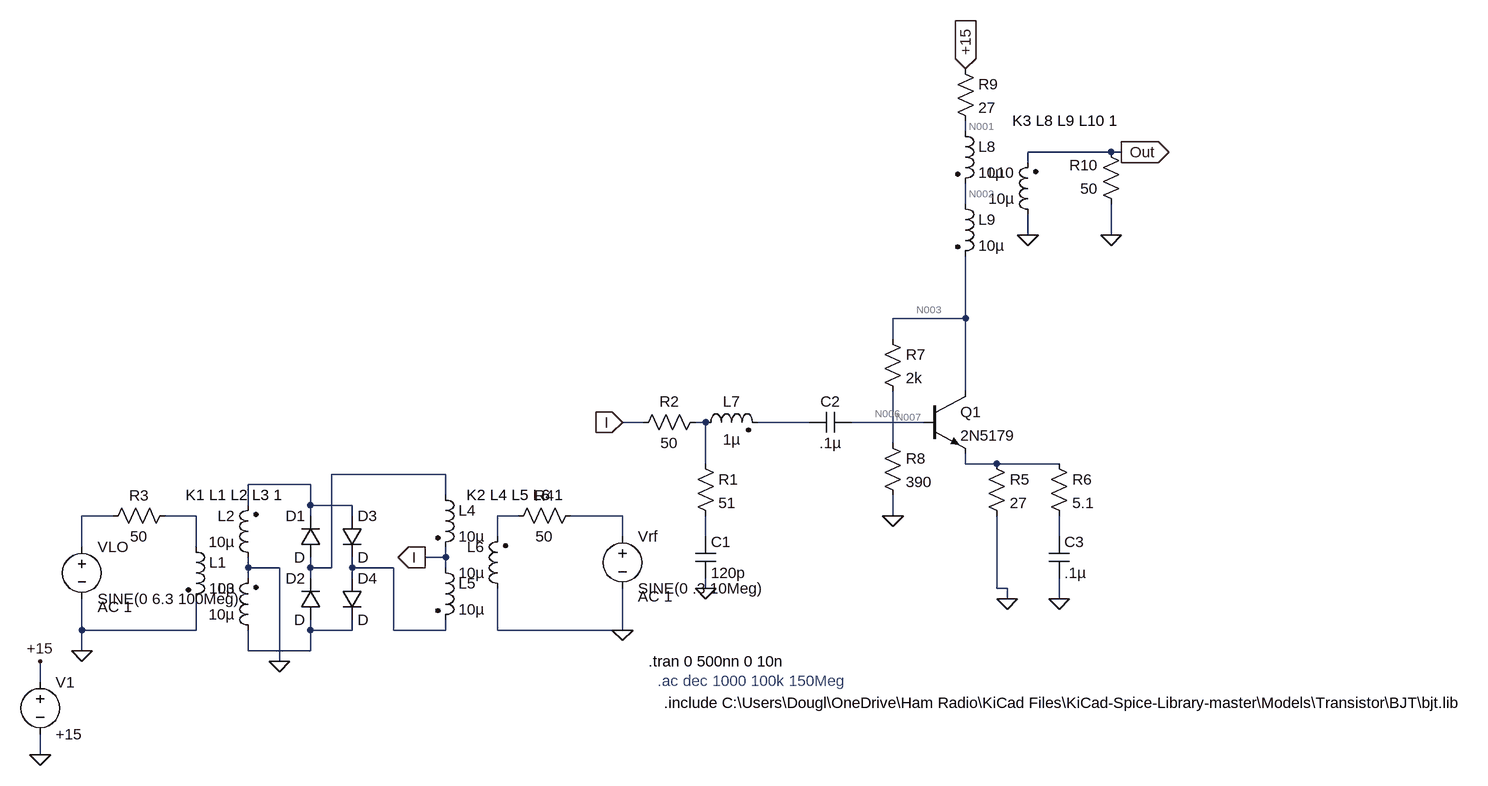
[diagram p0: schematic diplexer.asc]
diplexer.asc, the LTspice schematic file:
Version 4
SHEET 1 1020 680
WIRE 704 -368 704 -384
WIRE 928 -336 800 -336
WIRE 944 -336 928 -336
WIRE 800 -320 800 -336
WIRE 704 -256 704 -288
WIRE 800 -208 800 -240
WIRE 928 -208 928 -256
WIRE 704 -80 704 -176
WIRE 704 -80 592 -80
WIRE 592 -48 592 -80
WIRE 704 32 704 -80
WIRE 208 80 176 80
WIRE 304 80 288 80
WIRE 464 80 384 80
WIRE 640 80 528 80
WIRE 592 112 592 32
WIRE 304 144 304 80
WIRE 704 144 704 128
WIRE 752 144 704 144
WIRE 848 144 752 144
WIRE -96 160 -272 160
WIRE -304 176 -400 176
WIRE -96 192 -96 160
WIRE -400 208 -400 176
WIRE -304 208 -304 176
WIRE -240 208 -304 208
WIRE -608 224 -656 224
WIRE -480 224 -528 224
WIRE -304 224 -304 208
WIRE -240 224 -240 208
WIRE 16 224 -16 224
WIRE 176 224 96 224
WIRE 592 224 592 192
WIRE -16 256 -16 224
WIRE 176 256 176 224
WIRE 304 256 304 224
WIRE 848 256 848 224
WIRE -656 272 -656 224
WIRE -480 272 -480 224
WIRE -96 288 -96 272
WIRE -96 288 -128 288
WIRE -400 304 -400 288
WIRE -352 304 -400 304
WIRE -304 304 -304 288
WIRE -272 304 -272 160
WIRE -272 304 -304 304
WIRE -240 304 -240 288
WIRE -176 304 -240 304
WIRE -96 304 -96 288
WIRE -400 320 -400 304
WIRE -304 320 -304 304
WIRE -240 320 -240 304
WIRE 304 336 304 320
WIRE 752 336 752 224
WIRE 768 336 752 336
WIRE 768 352 768 336
WIRE 848 352 848 320
WIRE -656 400 -656 352
WIRE -480 400 -480 352
WIRE -480 400 -656 400
WIRE -304 400 -304 384
WIRE -240 400 -240 384
WIRE -240 400 -304 400
WIRE -176 400 -176 304
WIRE -96 400 -96 384
WIRE -96 400 -176 400
WIRE -16 400 -16 336
WIRE 176 400 176 336
WIRE 176 400 -16 400
WIRE -656 432 -656 400
WIRE -400 432 -400 400
WIRE -304 432 -304 400
WIRE -304 432 -400 432
WIRE -352 448 -352 304
WIRE -720 480 -720 448
WIRE -720 592 -720 560
FLAG -656 432 0
FLAG 176 400 0
FLAG 304 336 0
FLAG 944 -336 Out
IOPIN 944 -336 Out
FLAG -352 448 0
FLAG -128 288 I
IOPIN -128 288 Out
FLAG 176 80 I
IOPIN 176 80 In
FLAG 848 352 0
FLAG 768 352 0
FLAG 592 224 0
FLAG -720 592 0
FLAG -720 448 +15
FLAG 704 -464 +15
IOPIN 704 -464 In
FLAG 800 -208 0
FLAG 928 -208 0
SYMBOL voltage -656 256 R0
WINDOW 123 24 108 Left 2
WINDOW 39 24 108 Left 2
SYMATTR Value2 AC 1
SYMATTR InstName VLO
SYMATTR Value SINE(0 6.3 100Meg)
SYMBOL voltage 176 240 R0
WINDOW 123 24 108 Left 2
WINDOW 39 24 108 Left 2
SYMATTR Value2 AC 1
SYMATTR InstName Vrf
SYMATTR Value SINE(0 .3 10Meg)
SYMBOL ind2 288 96 R270
WINDOW 0 32 56 VTop 2
WINDOW 3 5 56 VBottom 2
SYMATTR InstName L7
SYMATTR Value 1µ
SYMATTR Type ind
SYMBOL res 288 128 R0
SYMATTR InstName R1
SYMATTR Value 51
SYMBOL cap 288 256 R0
SYMATTR InstName C1
SYMATTR Value 120p
SYMBOL cap 528 64 R90
WINDOW 0 0 32 VBottom 2
WINDOW 3 32 32 VTop 2
SYMATTR InstName C2
SYMATTR Value .1µ
SYMBOL res 304 64 R90
WINDOW 0 0 56 VBottom 2
WINDOW 3 32 56 VTop 2
SYMATTR InstName R2
SYMATTR Value 50
SYMBOL res -512 208 R90
WINDOW 0 0 56 VBottom 2
WINDOW 3 32 56 VTop 2
SYMATTR InstName R3
SYMATTR Value 50
SYMBOL ind2 -496 256 R0
SYMATTR InstName L1
SYMATTR Value 10µ
SYMATTR Type ind
SYMBOL res 112 208 R90
WINDOW 0 0 56 VBottom 2
WINDOW 3 32 56 VTop 2
SYMATTR InstName R4
SYMATTR Value 50
SYMBOL ind2 0 352 R180
WINDOW 0 36 80 Left 2
WINDOW 3 36 40 Left 2
SYMATTR InstName L6
SYMATTR Value 10µ
SYMATTR Type ind
SYMBOL diode -288 288 R180
WINDOW 0 24 64 Left 2
WINDOW 3 24 0 Left 2
SYMATTR InstName D1
SYMBOL diode -288 384 R180
WINDOW 0 24 64 Left 2
WINDOW 3 24 0 Left 2
SYMATTR InstName D2
SYMBOL ind2 -384 304 R180
WINDOW 0 36 80 Left 2
WINDOW 3 36 40 Left 2
SYMATTR InstName L2
SYMATTR Value 10µ
SYMATTR Type ind
SYMBOL ind2 -384 416 R180
WINDOW 0 36 80 Left 2
WINDOW 3 36 40 Left 2
SYMATTR InstName L3
SYMATTR Value 10µ
SYMATTR Type ind
SYMBOL ind2 -112 176 R0
SYMATTR InstName L4
SYMATTR Value 10µ
SYMATTR Type ind
SYMBOL ind2 -112 288 R0
SYMATTR InstName L5
SYMATTR Value 10µ
SYMATTR Type ind
SYMBOL diode -256 224 R0
SYMATTR InstName D3
SYMBOL diode -256 320 R0
SYMATTR InstName D4
SYMBOL npn 640 32 R0
SYMATTR InstName Q1
SYMATTR Value 2N5179
SYMBOL res 736 128 R0
SYMATTR InstName R5
SYMATTR Value 27
SYMBOL res 832 128 R0
SYMATTR InstName R6
SYMATTR Value 5.1
SYMBOL cap 832 256 R0
SYMATTR InstName C3
SYMATTR Value .1µ
SYMBOL res 576 -64 R0
SYMATTR InstName R7
SYMATTR Value 2k
SYMBOL res 576 96 R0
SYMATTR InstName R8
SYMATTR Value 390
SYMBOL voltage -720 464 R0
WINDOW 123 0 0 Left 0
WINDOW 39 0 0 Left 0
SYMATTR InstName V1
SYMATTR Value +15
SYMBOL res 688 -480 R0
SYMATTR InstName R9
SYMATTR Value 27
SYMBOL ind2 816 -224 R180
WINDOW 0 36 80 Left 2
WINDOW 3 36 40 Left 2
SYMATTR InstName L10
SYMATTR Value 10µ
SYMATTR Type ind
SYMBOL ind2 688 -384 R0
SYMATTR InstName L8
SYMATTR Value 10µ
SYMATTR Type ind
SYMBOL ind2 688 -272 R0
SYMATTR InstName L9
SYMATTR Value 10µ
SYMATTR Type ind
SYMBOL res 944 -240 R180
WINDOW 0 36 76 Left 2
WINDOW 3 36 40 Left 2
SYMATTR InstName R10
SYMATTR Value 50
TEXT 216 448 Left 2 !.tran 0 500nn 0 10n
TEXT -496 192 Left 2 !K1 L1 L2 L3 1
TEXT -64 192 Left 2 !K2 L4 L5 L6 1
TEXT 776 -384 Left 2 !K3 L8 L9 L10 1
TEXT 230 478 Left 2 ;.ac dec 1000 100k 150Meg
TEXT 240 512 Left 2 !.include C:\\Users\\Dougl\\OneDrive\\Ham Radio\\KiCad Files\\KiCad-Spice-Library-master\\Models\\Transistor\\BJT\\bjt.lib

The netlist it stands for:
* diplexer.asc
VLO N011 0 SINE(0 6.3 100Meg) AC 1
Vrf N014 0 SINE(0 .3 10Meg) AC 1
L7 N004 N005 1µ
R1 N004 N015 51
C1 N015 0 120p
C2 N006 N005 .1µ
R2 N004 I 50
R3 N012 N011 50
L1 N012 0 10µ
R4 N014 N013 50
L6 0 N013 10µ
D1 N009 N010 D
D2 N018 N009 D
L2 0 N010 10µ
L3 N018 0 10µ
L4 N009 I 10µ
L5 I N017 10µ
D3 N010 N017 D
D4 N017 N018 D
Q1 N003 N006 N008 0 2N5179
R5 N008 0 27
R6 N008 N016 5.1
C3 N016 0 .1µ
R7 N003 N007 2k
R8 N007 0 390
V1 +15 0 +15
R9 +15 N001 27
L10 0 Out 10µ
L8 N001 N002 10µ
L9 N002 N003 10µ
R10 0 Out 50
.model D D
.lib standard.dio
.model NPN NPN
.model PNP PNP
.lib standard.bjt
.tran 0 500nn 0 10n
K1 L1 L2 L3 1
K2 L4 L5 L6 1
K3 L8 L9 L10 1
* .ac dec 1000 100k 150Meg
.include C:\Users\Dougl\OneDrive\Ham Radio\KiCad Files\KiCad-Spice-Library-master\Models\Transistor\BJT\bjt.lib
.backanno
.end

* Results of the author's LTspice run, read from the files saved beside the schematic
* Operating Point, zero values left out:
*   V(n006) = 371.2 mV
*   V(n003) = 14.83 V
*   V(n007) = 2.42 V
*   V(+15) = 15 V
*   V(n001) = 14.83 V
*   V(n002) = 14.83 V
*   Ic(Q1) = 148.4 pA
*   Ie(Q1) = -148.4 pA
*   I(L9) = 6.206 mA
*   I(L8) = 6.206 mA
*   I(R9) = 6.206 mA
*   I(R8) = 6.206 mA
*   I(R7) = 6.206 mA
*   I(R5) = 148.4 pA
*   I(V1) = -6.206 mA
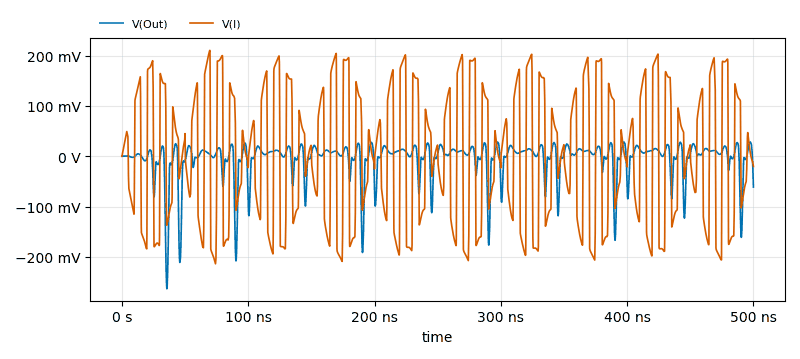
[diagram p1: Transient Analysis of diplexer.asc, plotted from the saved traces]
* Transient Analysis, 1 run:
*   V(Out): min -263.5 mV, max 28.36 mV, average -4.919 mV, rms 38.75 mV, last -61.29 mV
*   V(I): min -213.8 mV, max 210.4 mV, average -324 µV, rms 131.6 mV, last -20.39 mV